# EAGLE schematic valhalla-electrics (EAGLE 9.2.1)
Electrical Network Operation "Valhalla" CLASSIFIED: SECRET, NEED-TO-KNOW-ONLY This is the a schematic of the electrical network, it tries to mimic the physical placement of all components in an attempt to provide the data for conduit loading.

## Sheet 1 of 2: Ground floor Ground floor wiring, for sizing conduits
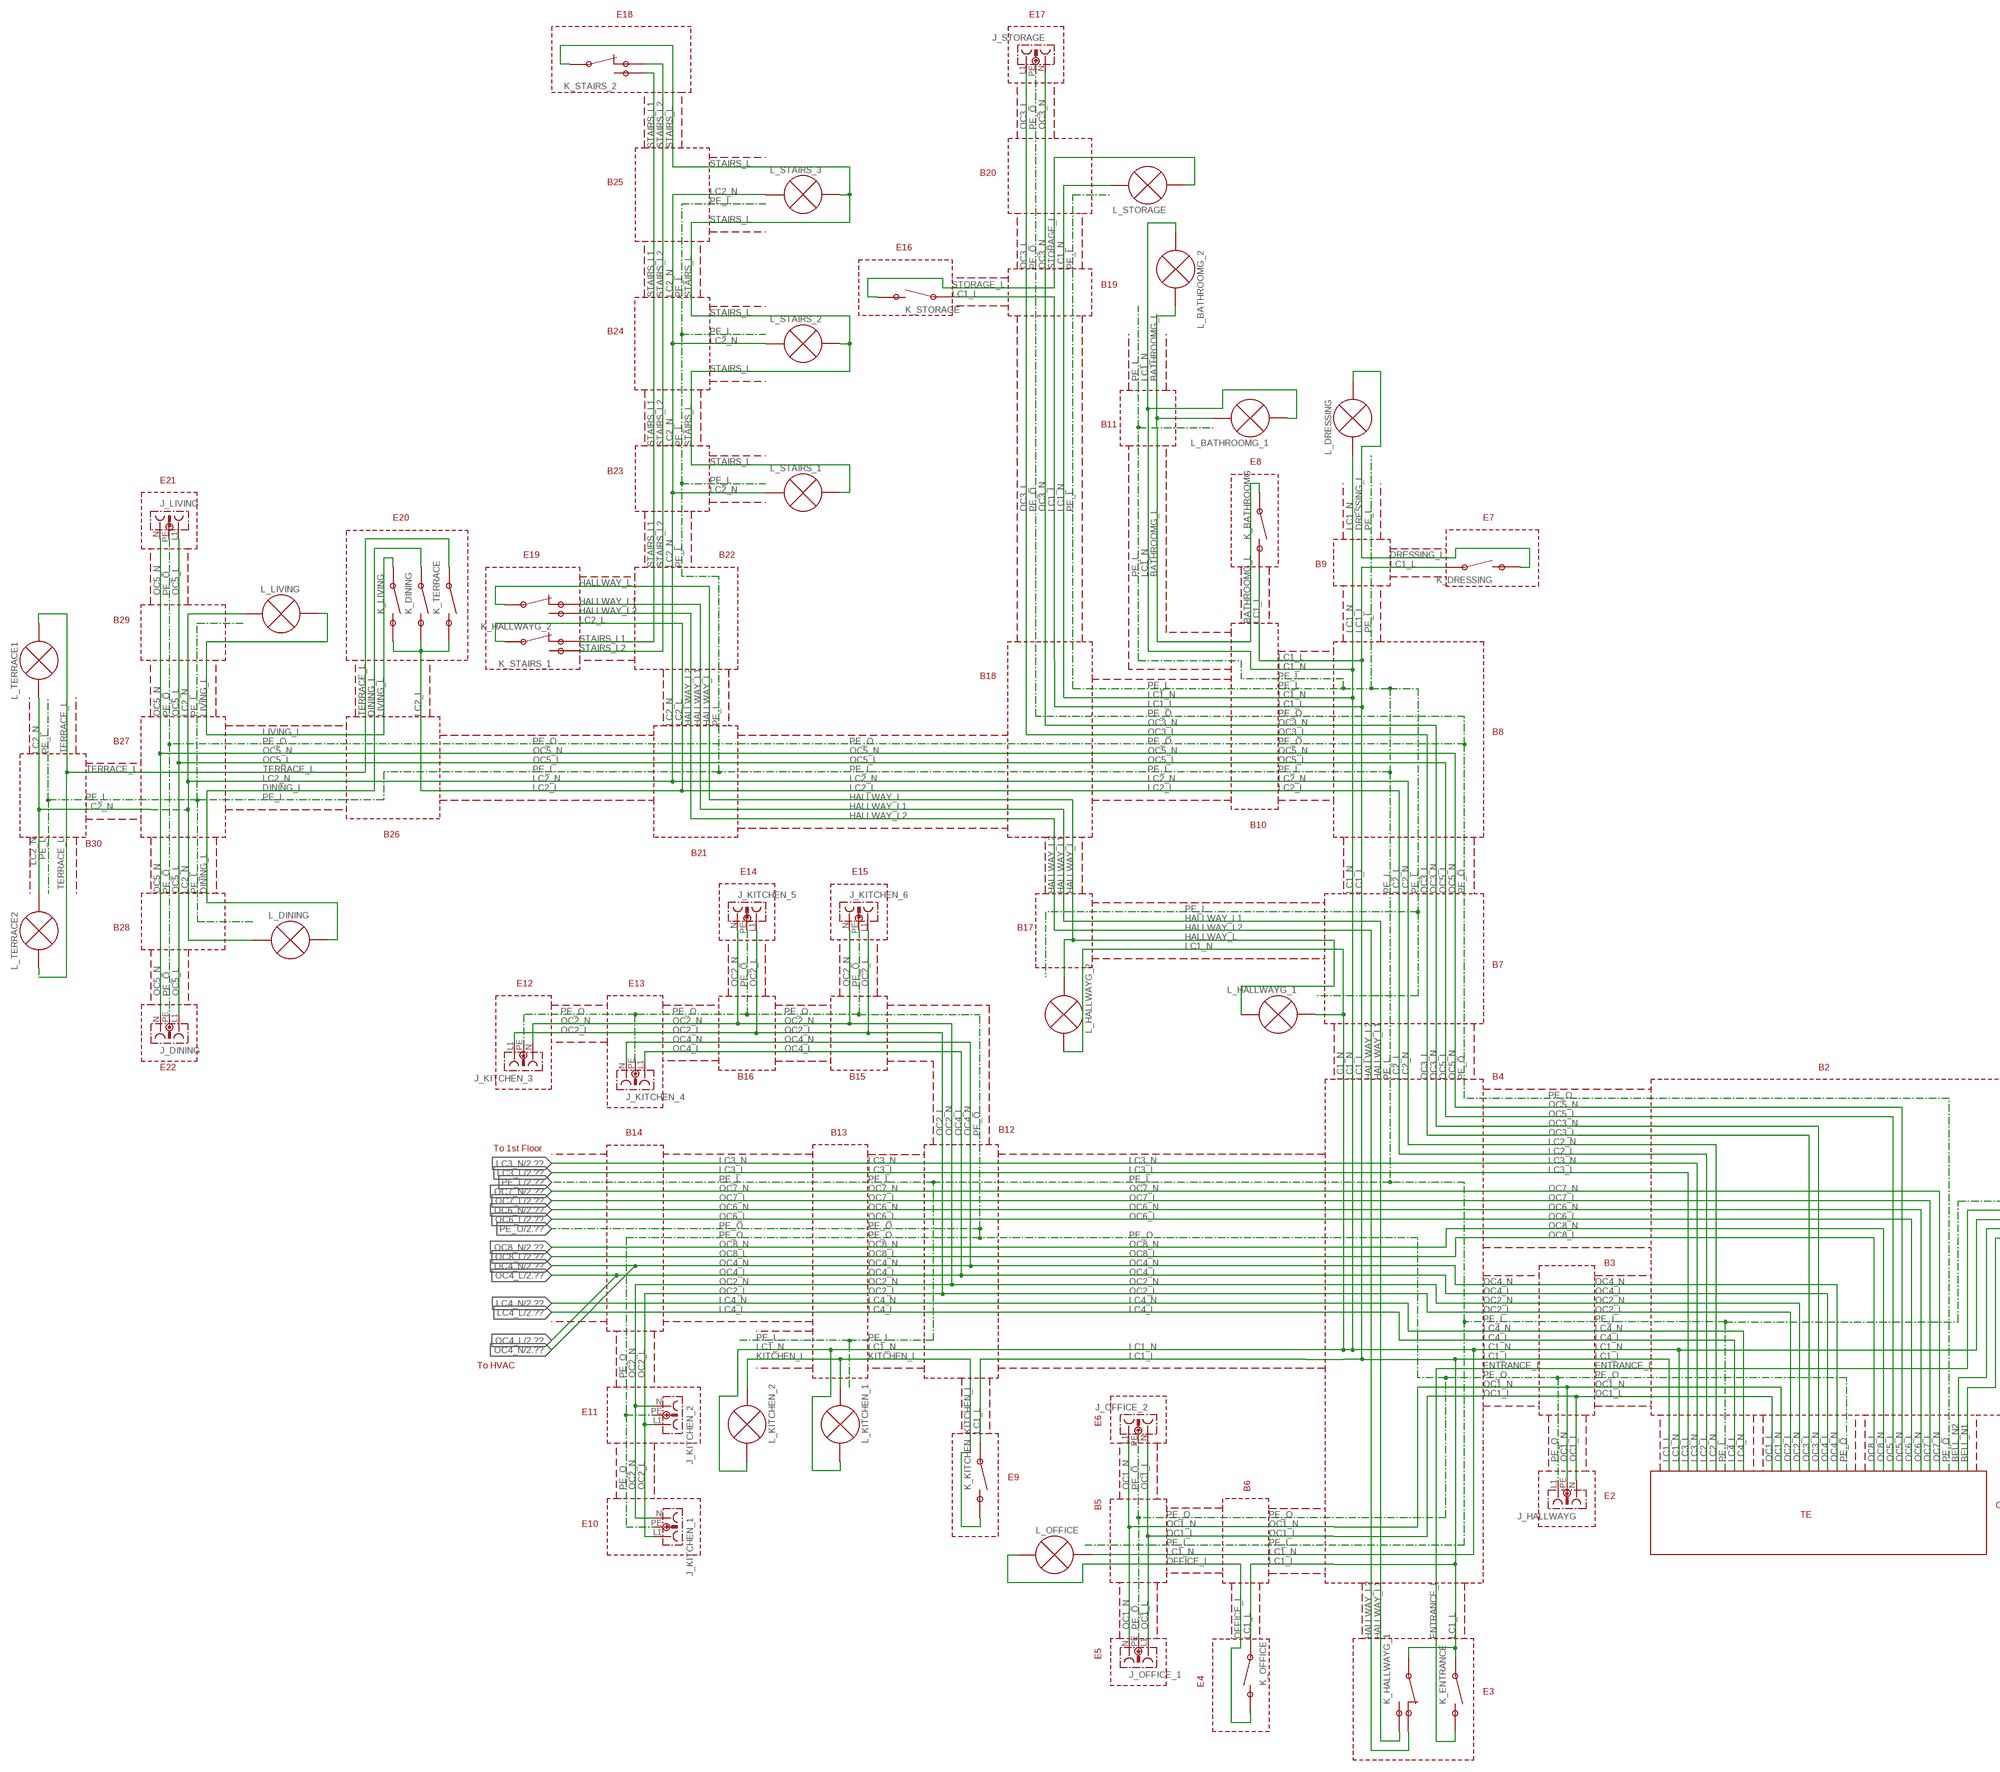
[diagram p0: schematic, sheet 1, part 1 of 2]
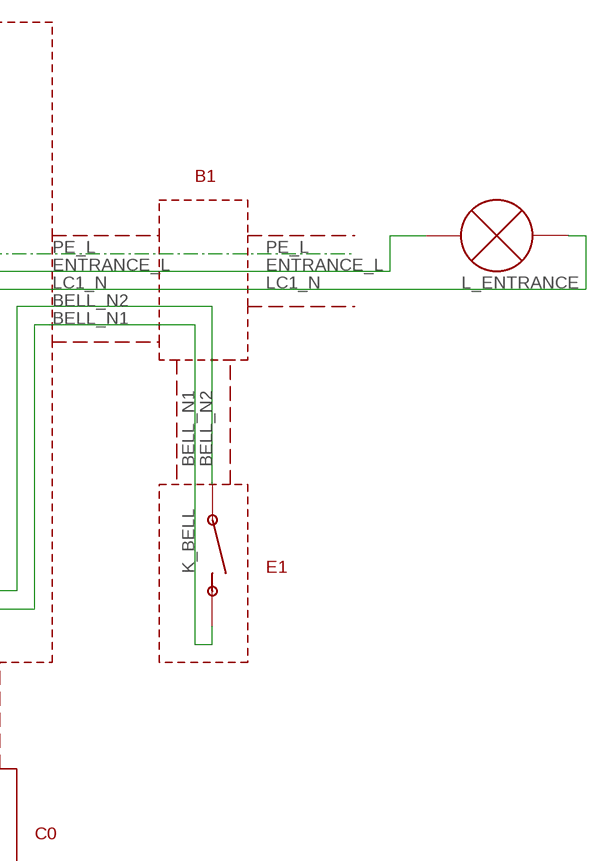
[diagram p1: schematic, sheet 1, part 2 of 2]

### Parts
J_DINING  STECKDOSE  [STECKDOSE]
J_HALLWAYG  STECKDOSE  [STECKDOSE]
J_KITCHEN_1  STECKDOSE  [STECKDOSE]
J_KITCHEN_2  STECKDOSE  [STECKDOSE]
J_KITCHEN_3  STECKDOSE  [STECKDOSE]
J_KITCHEN_4  STECKDOSE  [STECKDOSE]
J_KITCHEN_5  STECKDOSE  [STECKDOSE]
J_KITCHEN_6  STECKDOSE  [STECKDOSE]
J_LIVING  STECKDOSE  [STECKDOSE]
J_OFFICE_1  STECKDOSE  [STECKDOSE]
J_OFFICE_2  STECKDOSE  [STECKDOSE]
J_STORAGE  STECKDOSE  [STECKDOSE]

### Nets
OC1_L: J_HALLWAYG.N J_OFFICE_1.L1 J_OFFICE_2.N
OC1_N: J_HALLWAYG.PE J_OFFICE_1.N J_OFFICE_2.L1
OC2_L: J_KITCHEN_1.L1 J_KITCHEN_2.L1 J_KITCHEN_3.L1 J_KITCHEN_5.L1 J_KITCHEN_6.L1
OC2_N: J_KITCHEN_1.N J_KITCHEN_2.N J_KITCHEN_3.N J_KITCHEN_5.N J_KITCHEN_6.N
OC3_L: J_STORAGE.L1
OC3_N: J_STORAGE.N
OC4_L: J_KITCHEN_4.L1 ; also sheet 2
OC4_N: J_KITCHEN_4.N ; also sheet 2
OC5_L: J_DINING.L1 J_LIVING.L1
OC5_N: J_DINING.N J_LIVING.N
PE_O: J_DINING.PE J_HALLWAYG.L1 J_KITCHEN_1.PE J_KITCHEN_2.PE J_KITCHEN_3.PE J_KITCHEN_4.PE J_KITCHEN_5.PE J_KITCHEN_6.PE J_LIVING.PE J_OFFICE_1.PE J_OFFICE_2.PE J_STORAGE.PE ; also sheet 2

### Notes on the sheet
- E18 | E17
- B20
- B25
- E16
- B19
- B24
- B11
- E8
- B23
- E21
- E20 | E7
- E19 | B22
- B9
- B29
- B18
- B8
- B27
- B10
- B26
- B30
- B21
- E14 | E15
- B28 | B17
- B7
- E12 | E13
- E22 | B2
- B16 | B15 | B4
- B12
- B14 | B13
- To 1st Floor
- B1
- B3
- To HVAC | E1
- E11 | E6
- E9 | B6
- B5 | E2
- C0
- TE
- E10
- E5
- E4
- E3

## Sheet 2 of 2: First floor First floor wiring, for sizing conduits
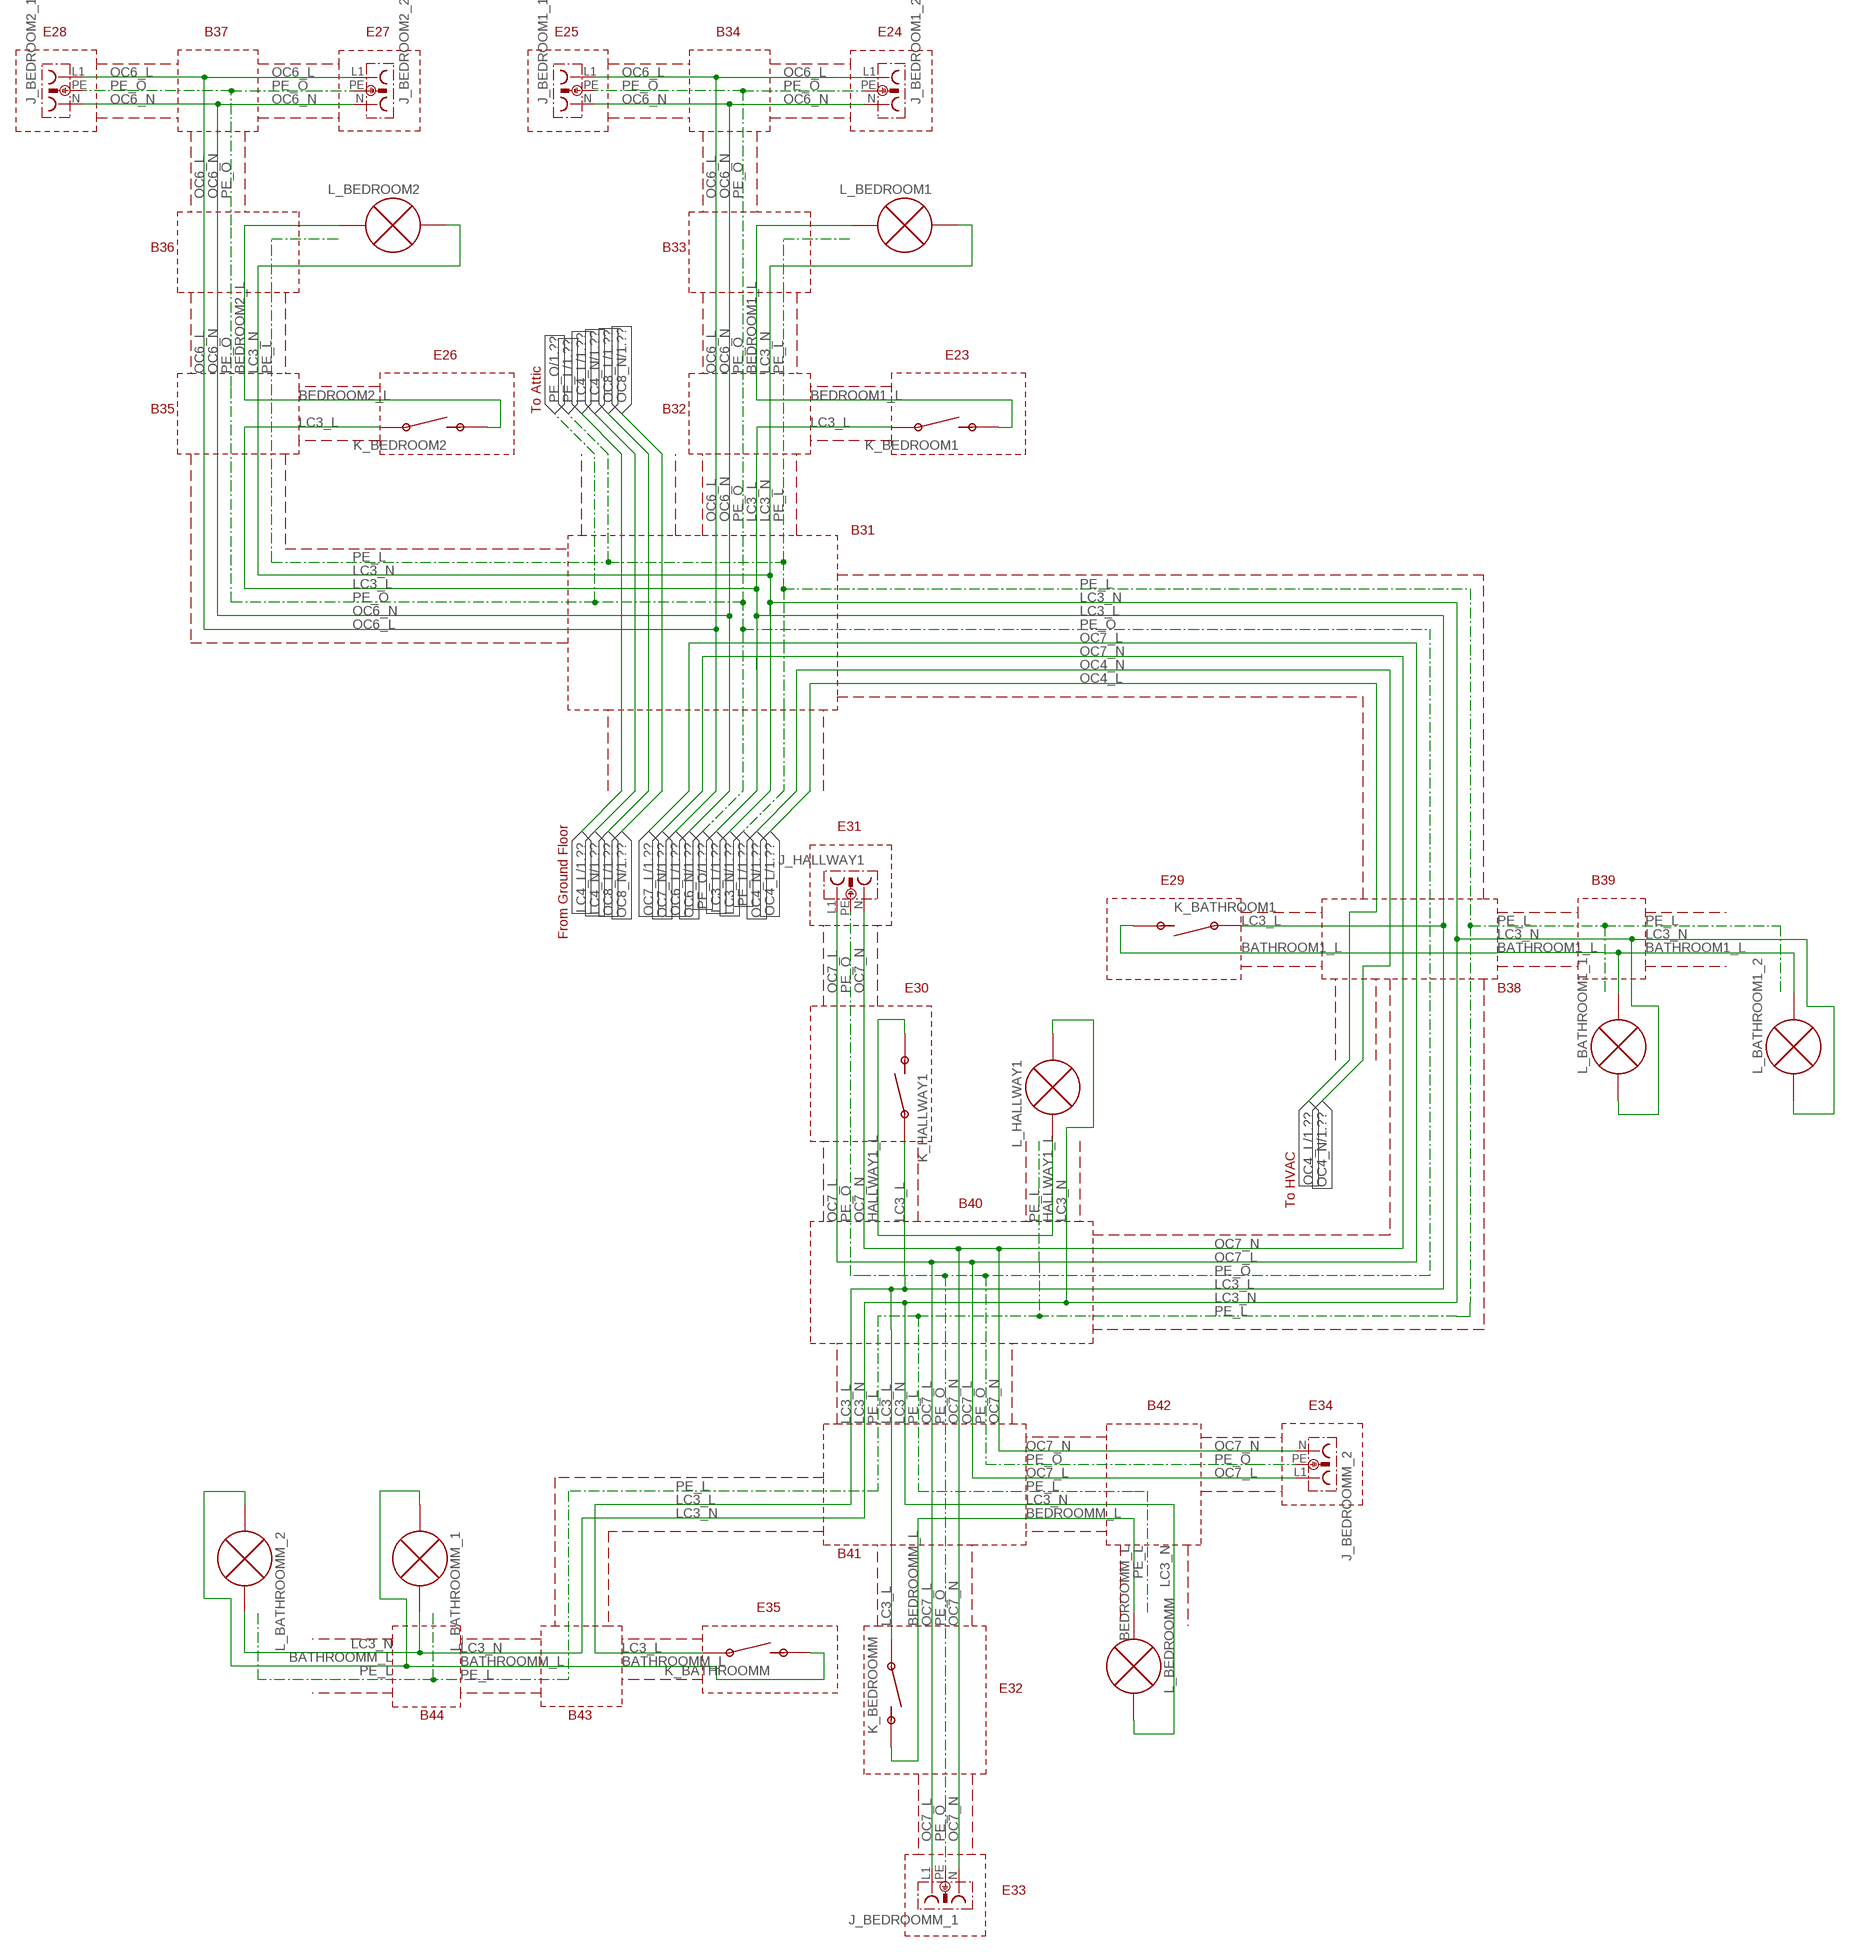
[diagram p2: schematic, sheet 2]

### Parts
J_BEDROOM1_1  STECKDOSE  [STECKDOSE]
J_BEDROOM1_2  STECKDOSE  [STECKDOSE]
J_BEDROOM2_1  STECKDOSE  [STECKDOSE]
J_BEDROOM2_2  STECKDOSE  [STECKDOSE]
J_BEDROOMM_1  STECKDOSE  [STECKDOSE]
J_BEDROOMM_2  STECKDOSE  [STECKDOSE]
J_HALLWAY1  STECKDOSE  [STECKDOSE]

### Nets
OC6_L: J_BEDROOM1_1.L1 J_BEDROOM1_2.L1 J_BEDROOM2_1.L1 J_BEDROOM2_2.L1 ; also sheet 1
OC6_N: J_BEDROOM1_1.N J_BEDROOM1_2.N J_BEDROOM2_1.N J_BEDROOM2_2.N ; also sheet 1
OC7_L: J_BEDROOMM_1.L1 J_BEDROOMM_2.L1 J_HALLWAY1.L1 ; also sheet 1
OC7_N: J_BEDROOMM_1.N J_BEDROOMM_2.N J_HALLWAY1.N ; also sheet 1
PE_O: J_BEDROOM1_1.PE J_BEDROOM1_2.PE J_BEDROOM2_1.PE J_BEDROOM2_2.PE J_BEDROOMM_1.PE J_BEDROOMM_2.PE J_HALLWAY1.PE ; also sheet 1

### Notes on the sheet
- E28 | B37 | E27 | E25 | B34 | E24
- B36 | B33
- E26 | E23
- B35 | To Attic | B32
- B31
- E31
- E29 | B39
- From Ground Floor
- E30 | B38
- B40 | To HVAC
- B42 | E34
- B41
- E35
- E32
- B44 | B43
- E33

## Library data of the parts
J_BEDROOM1_1 J_BEDROOM1_2 J_BEDROOM2_1 J_BEDROOM2_2 J_BEDROOMM_1 J_BEDROOMM_2 J_DINING J_HALLWAY1 J_HALLWAYG J_KITCHEN_1-J_KITCHEN_6 J_LIVING J_OFFICE_1 J_OFFICE_2 J_STORAGE = e-steckverbinder:STECKDOSE: Steckdose mit Schutzleiter